# EasyEDA Pro project ProProject_Driver_STM32F405_2023-10-07.epro, board PCB1_1
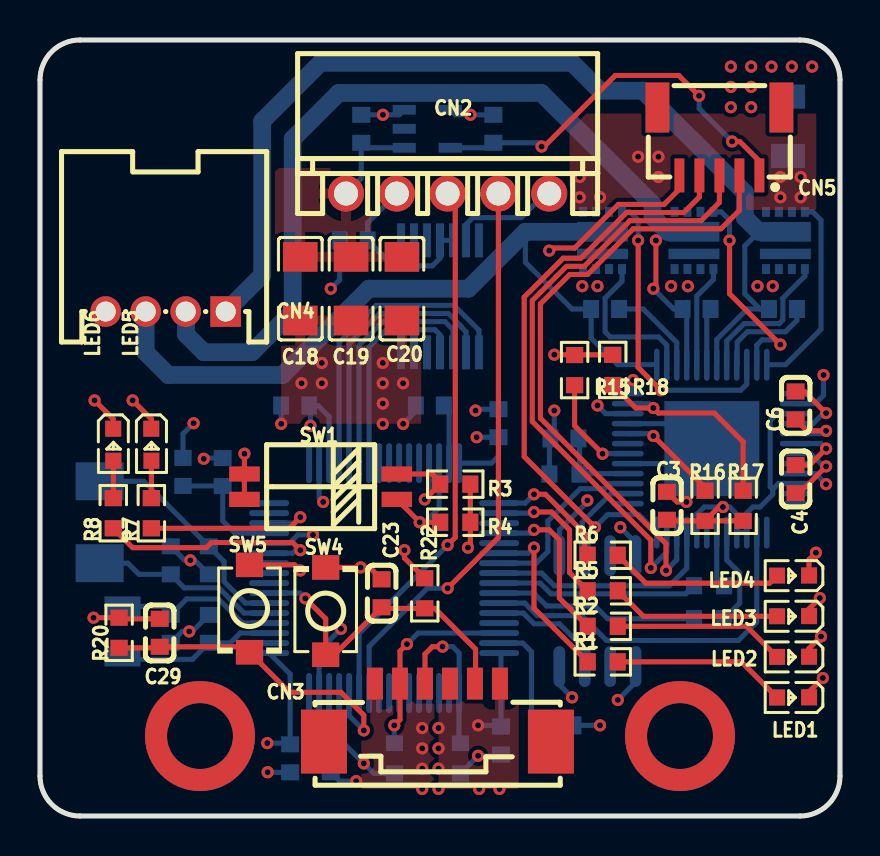
[diagram p6: board, top side]
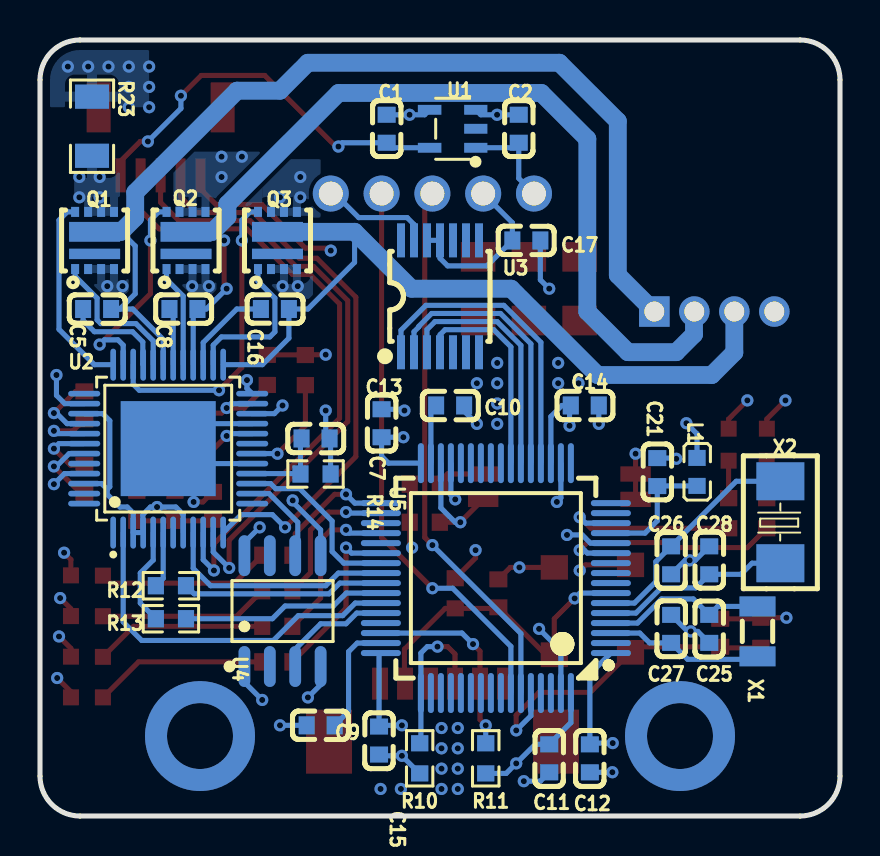
[diagram p7: board, bottom side, seen from below]

Outline 40 x 38.82 mm; copper layers: Top Layer, Inner1, Inner2, Bottom Layer. Coordinates in mm from the lower left corner of the outline.
Outline path: 0,36.82 0,2 arc(0.59,0.59) 2,0 38,0 arc(39.41,0.59) 40,2 40,36.82 arc(39.41,38.24) 38,38.82 2,38.82 arc(0.59,38.24) 0,36.82
Stack: Top Layer 0.035mm / Dielectric1 0.48mm PP er 4.5 / Inner1 0.035mm / Dielectric2 0.48mm FR4 er 4.5 / Inner2 0.035mm / Dielectric3 0.48mm PP er 4.5 / Bottom Layer 0.035mm

## Design rules (mm)
spacing safeClearance (default): track to track 0.152, other pairs 0.152 to 0.3
track width trackWidth (default): min 0.127, default 0.254, max 2.54
differential pair differentialPair (default): width min 0.127, default 0.254, max 2.54; gap min 0.152, default 0.152
via viaSize (default): diameter min 0.5, default 0.61, max 10; hole min 0.3, default 0.305, max 6
net GND uses copperRegion1
net VCC uses copperRegion1
net GND_CS uses copperRegion1
net +16V uses copperRegion1

## Placement (name value [footprint] x y rotation side)
C1  4.7uF  [C0603]  22.67 34.38 270 bottom
C2  10uF  [C0603]  16.06 34.38 270 bottom
C3  1uF  [C0603]  31.35 15.52 270 top
C4  470nF  [C0603]  37.78 16.86 270 top
C5  33nF  [C0603]  37.15 25.36 0 bottom
C6  1uF  [C0603]  37.78 20.54 270 top
C7  1nF  [C0603]  26.22 18.89 0 bottom
C8  33nF  [C0603]  32.83 25.36 0 bottom
C9  100nF  [C0603]  25.97 4.54 180 bottom
C10  100nF  [C0603]  19.49 20.54 0 bottom
C11  100nF  [C0603]  14.54 2.89 90 bottom
C12  100nF  [C0603]  12.51 2.89 90 bottom
C13  100nF  [C0603]  22.92 19.65 270 bottom
C14  100nF  [C0603]  12.76 20.54 0 bottom
C15  100nF  [C0603]  23.05 3.78 90 bottom
C16  33nF  [C0603]  28.25 25.36 0 bottom
C17  100nF  [C0603]  15.68 28.79 180 bottom
C18  10uF  [C1206]  13.01 26.38 90 top
C19  10uF  [C1206]  15.56 26.38 90 top
C20  10uF  [C1206]  18.09 26.38 90 top
C21  100nF  [C0603]  9.14 17.21 270 bottom
C23  100nF  [C0603]  17.08 11.14 270 top
C25  20pF  [C0603]  6.54 9.36 90 bottom
C26  20pF  [C0603]  8.44 12.79 90 bottom
C27  20pF  [C0603]  8.44 9.36 270 bottom
C28  20pF  [C0603]  6.54 12.79 270 bottom
C29  100nF  [C0603]  5.99 9.17 90 top
CN2  5264-5AWD米色  [CONN-TH_5P-P2.50_5264-5AWD]  20.38 31.84 0 top
CN3  532610671  [CONN-SMD_6P-P1.25_53261-0671]  19.87 5.17 0 top
CN4  X2011WR-04A-N0SN  [CONN-TH_X2011WR-04A-N0SN]  6.28 25.24 180 top
CN5  X1002WRS-05L-HF-LPSW  [CONN-SMD_X1002WRS-05L-HF-LPSN]  33.97 33.75 180 top
L1  3.3uH  [L0603]  7.15 17.22 270 bottom
LED1  XL-1608SURC-06  [LED0603-RD_RED]  37.65 5.93 180 top
LED2  XL-1608SYGC-06  [LED0603-RD_GREEN]  37.65 7.97 180 top
LED3  XL-1608SYGC-06  [LED0603-RD_GREEN]  37.65 10 180 top
LED4  XL-1608SYGC-06  [LED0603-RD_GREEN]  37.65 12.03 180 top
LED5  XL-1608UBC-04  [LED0603-RD_BLUE]  5.57 18.58 270 top
LED6  XL-1608UBC-04  [LED0603-RD_BLUE]  3.66 18.58 270 top
Q1  TDM3412  [DFN3X3E-8_L3.0-W3.0-P0.65-BL-EP2]  37.27 28.79 180 bottom
Q2  TDM3412  [DFN3X3E-8_L3.0-W3.0-P0.65-BL-EP2]  32.7 28.79 180 bottom
Q3  TDM3412  [DFN3X3E-8_L3.0-W3.0-P0.65-BL-EP2]  28.13 28.79 180 bottom
R1  1kΩ  [R0603]  28.14 7.71 180 top
R2  1kΩ  [R0603]  28.14 9.49 180 top
R3  806kΩ  [R0603]  20.76 16.6 0 top
R4  806kΩ  [R0603]  20.76 14.7 0 top
R5  1kΩ  [R0603]  28.14 11.27 180 top
R6  1kΩ  [R0603]  28.14 13.05 180 top
R7  1kΩ  [R0603]  5.57 15.15 270 top
R8  1kΩ  [R0603]  3.66 15.15 270 top
R10  10kΩ  [R0603]  21.02 2.89 90 bottom
R11  10kΩ  [R0603]  17.71 2.89 90 bottom
R12  1kΩ  [R0603]  33.45 11.52 0 bottom
R13  1kΩ  [R0603]  33.45 9.87 0 bottom
R14  47kΩ  [R0603]  26.22 17.11 0 bottom
R15  10kΩ  [R0603]  26.73 22.31 90 top
R16  100kΩ  [R0603]  33.25 15.52 90 top
R17  100kΩ  [R0603]  35.16 15.52 90 top
R18  10kΩ  [R0603]  28.64 22.32 270 top
R20  10kΩ  [R0603]  3.96 9.17 90 top
R22  10kΩ  [R0603]  19.24 11.14 90 top
R23  25mΩ  [R1206]  37.4 34.51 270 bottom
SW1  DSHP02TSGER  [SW-SMD_DSHP02TSGER]  14.03 16.47 90 top
SW4  TS-1088-AR02016  [SW-SMD_L3.9-W3.0-P4.45]  14.28 10.25 90 top
SW5  TS-1088-AR02016  [SW-SMD_L3.9-W3.0-P4.45]  10.47 10.38 270 top
U1  TPS7B6950DBVR  [SOT-23-5_L3.0-W1.7-P0.95-LS2.8-BL]  19.37 34.38 90 bottom
U2  A3930KJPTR-T  [LQFP-48_L7.0-W7.0-P0.50-LS9.0-BL-EP]  33.59 18.38 180 bottom
U3  AS5047P-ATSM  [TSSOP-14_L5.0-W4.4-P0.65-LS6.4-BL]  20 26 180 bottom
U4  π122U31  [SOIC-8_L4.9-W3.9-P1.27-LS6.0-BL]  27.87 10.25 180 bottom
U5  STM32F405RGT6  [LQFP-64_L10.0-W10.0-P0.50-LS12.0-BL]  17.21 11.9 90 bottom
X1  32.768kHz  [FC-135R_L3.2-W1.5]  4.12 9.24 270 bottom
X2  8MHz  [CRYSTAL-SMD_L5.0-W3.2]  2.98 14.7 270 bottom

## Footprints (pads in the part's own frame, mm; a bottom-side part is the same pattern mirrored in y, then rotated)
C0603
  rect 0.8x0.9 smd: 1(-0.7,0) 2(0.7,0)
C1206
  rect 1.485x1.728 smd: 1(-1.593,0) 2(1.593,0)
CONN-SMD_6P-P1.25_53261-0671
  rect 0.8x1.6 smd: 1(3.124,1.45) 2(1.875,1.45) 3(0.625,1.45) 4(-0.625,1.45) 5(-1.875,1.45) 6(-3.124,1.45)
  rect 2.301x3.2 smd: 7(-5.675,-1.45) 8(5.675,-1.45)
CONN-SMD_X1002WRS-05L-HF-LPSN
  rect 0.5x1.7 smd: 1(-2,1.7) 2(-1,1.7) 3(0,1.7) 4(1,1.7) 5(2,1.7)
  rect 1.2x2.5 smd: 6(3.1,-1.7) 7(-3.1,-1.7)
CONN-TH_5P-P2.50_5264-5AWD
  round 1.801 hole 1.199: 1(-5.08,-0.701) 2(-2.54,-0.701) 3(0,-0.701) 4(2.54,-0.701) 5(5.08,-0.701)
CONN-TH_X2011WR-04A-N0SN
  rect 1.524x1.524 hole 1: 1(-3,0)
  round 1.524 hole 1: 2(-1,0) 3(1,0) 4(3,0)
CRYSTAL-SMD_L5.0-W3.2
  rect 1.9x2.4 smd: 1(-2.05,0) 2(2.05,0)
DFN3X3E-8_L3.0-W3.0-P0.65-BL-EP2
  rect 0.4x0.5 smd: 1(-0.973,-1.43) 2(-0.323,-1.43) 3(0.328,-1.43) 4(0.973,-1.43) 5(0.973,1.43) 6(0.328,1.43) 7(-0.323,1.43) 8(-0.973,1.43)
  rect 2.55x0.52 smd: 9(0.003,-0.672)
  rect 2.55x0.99 smd: 10(0.003,0.433)
FC-135R_L3.2-W1.5
  rect 1x1.8 smd: 1(-1.25,0) 2(1.25,0)
L0603
  rect 0.8x0.864 smd: 1(-0.7,0) 2(0.7,0)
LED0603-RD_BLUE
  rect 0.8x0.8 smd: 1(-0.799,-0.004) 2(0.799,0.004)
LED0603-RD_GREEN
  rect 0.8x0.8 smd: 1(-0.799,-0.004) 2(0.799,0.004)
LED0603-RD_RED
  rect 0.8x0.8 smd: 1(-0.799,-0.004) 2(0.799,0.004)
LQFP-48_L7.0-W7.0-P0.50-LS9.0-BL-EP
  oval 0.28x1.6 smd: 1(-2.75,-4.2) 2(-2.25,-4.2) 3(-1.75,-4.2) 4(-1.25,-4.2) 5(-0.75,-4.2) 6(-0.25,-4.2) 7(0.25,-4.2) 8(0.75,-4.2) 9(1.25,-4.2) 10(1.75,-4.2) 11(2.25,-4.2) 12(2.75,-4.2) 25(2.75,4.2) 26(2.25,4.2) 27(1.75,4.2) 28(1.25,4.2) 29(0.75,4.2) 30(0.25,4.2) 31(-0.25,4.2) 32(-0.75,4.2) 33(-1.25,4.2) 34(-1.75,4.2) 35(-2.25,4.2) 36(-2.75,4.2)
  oval 1.6x0.28 smd: 13(4.2,-2.75) 14(4.2,-2.25) 15(4.2,-1.75) 16(4.2,-1.25) 17(4.2,-0.75) 18(4.2,-0.25) 19(4.2,0.25) 20(4.2,0.75) 21(4.2,1.25) 22(4.2,1.75) 23(4.2,2.25) 24(4.2,2.75) 37(-4.2,2.75) 38(-4.2,2.25) 39(-4.2,1.75) 40(-4.2,1.25) 41(-4.2,0.75) 42(-4.2,0.25) 43(-4.2,-0.25) 44(-4.2,-0.75) 45(-4.2,-1.25) 46(-4.2,-1.75) 47(-4.2,-2.25) 48(-4.2,-2.75)
  rect 4.75x4.75 smd: 49(0,0)
LQFP-64_L10.0-W10.0-P0.50-LS12.0-BL
  oval 0.3x2 smd: 1(-3.75,-5.75) 2(-3.25,-5.75) 3(-2.75,-5.75) 4(-2.25,-5.75) 5(-1.75,-5.75) 6(-1.25,-5.75) 7(-0.75,-5.75) 8(-0.25,-5.75) 9(0.25,-5.75) 10(0.75,-5.75) 11(1.25,-5.75) 12(1.75,-5.75) 13(2.25,-5.75) 14(2.75,-5.75) 15(3.25,-5.75) 16(3.75,-5.75) 33(3.75,5.75) 34(3.25,5.75) 35(2.75,5.75) 36(2.25,5.75) 37(1.75,5.75) 38(1.25,5.75) 39(0.75,5.75) 40(0.25,5.75) 41(-0.25,5.75) 42(-0.75,5.75) 43(-1.25,5.75) 44(-1.75,5.75) 45(-2.25,5.75) 46(-2.75,5.75) 47(-3.25,5.75) 48(-3.75,5.75)
  oval 2x0.3 smd: 17(5.75,-3.75) 18(5.75,-3.25) 19(5.75,-2.75) 20(5.75,-2.25) 21(5.75,-1.75) 22(5.75,-1.25) 23(5.75,-0.75) 24(5.75,-0.25) 25(5.75,0.25) 26(5.75,0.75) 27(5.75,1.25) 28(5.75,1.75) 29(5.75,2.25) 30(5.75,2.75) 31(5.75,3.25) 32(5.75,3.75) 49(-5.75,3.75) 50(-5.75,3.25) 51(-5.75,2.75) 52(-5.75,2.25) 53(-5.75,1.75) 54(-5.75,1.25) 55(-5.75,0.75) 56(-5.75,0.25) 57(-5.75,-0.25) 58(-5.75,-0.75) 59(-5.75,-1.25) 60(-5.75,-1.75) 61(-5.75,-2.25) 62(-5.75,-2.75) 63(-5.75,-3.25) 64(-5.75,-3.75)
R0603
  rect 0.806x0.864 smd: 1(-0.753,0) 2(0.753,0)
R1206
  rect 1.208x1.701 smd: 1(-1.479,0) 2(1.479,0)
SOIC-8_L4.9-W3.9-P1.27-LS6.0-BL
  oval 0.588x2.045 smd: 1(-1.905,-2.772) 2(-0.635,-2.772) 3(0.635,-2.772) 4(1.905,-2.772) 5(1.905,2.772) 6(0.635,2.772) 7(-0.635,2.772) 8(-1.905,2.772)
SOT-23-5_L3.0-W1.7-P0.95-LS2.8-BL
  rect 0.49x1.157 smd: 1(-0.95,-1.153) 2(0,-1.153) 3(0.95,-1.153)
  rect 0.49x1.175 smd: 4(0.95,1.153) 5(-0.95,1.153)
SW-SMD_DSHP02TSGER
  rect 0.762x1.524 smd: 1(-0.635,-3.81) 2(0.635,-3.81) 3(0.635,3.81) 4(-0.635,3.81)
SW-SMD_L3.9-W3.0-P4.45
  rect 1.23x1.36 smd: 1(-2.185,0) 2(2.185,0)
TSSOP-14_L5.0-W4.4-P0.65-LS6.4-BL
  rect 0.4x1.7 smd: 1(-1.95,-2.8) 2(-1.3,-2.8) 3(-0.65,-2.8) 4(0,-2.8) 5(0.65,-2.8) 6(1.3,-2.8) 7(1.95,-2.8) 8(1.95,2.8) 9(1.3,2.8) 10(0.65,2.8) 11(0,2.8) 12(-0.65,2.8) 13(-1.3,2.8) 14(-1.95,2.8)

## Nets
As in the schematic.

Pads without a net: CN3 3 7 8; CN4 4; CN5 6 7; U1 2; U2 1 7 13 19 37 44 47 48; U3 5 6 7 8 9 10 14; U4 2 7; U5 2 8 9 10 15 16 17 24 25 26 27 35 37 45 50 51 52 53 54 55 56 57 61 62

## Via types
v1: diameter 5.5, hole 3.3, Top Layer to Bottom Layer, 2 vias
v2: diameter 0.61, hole 0.305, Top Layer to Bottom Layer, 124 vias

## Routing (per net, layer and track width the routed paths; a pad name or vN(x,y) marks a point on that pad's centre or on a via; arc(x,y) is an arc through that point)
+5V: length 20
  Top Layer w0.254: v2(25.08,33.49) 25.21,33.49 28.76,37.05 31.94,37.05 v2(32.95,36.03) ; v2(34.6,33.75) 34.99,33.75 35.97,32.76 CN5.1
  Bottom Layer w0.254: v2(34.6,33.75) 32.95,35.4 v2(32.95,36.03) ; U1.5 22.42,33.43 C1.2 24.89,33.68 v2(25.08,33.49)
+16V: length 24.4
  Inner1 w0.254: v2(39.3,16.6) 35.88,20.03 v2(35.88,26.51) ; v2(29.65,21.81) 29.65,24.73 v2(27.87,26.51)
  Bottom Layer w0.254: U2.24 29.65,21.39 v2(29.65,21.81) ; U2.45 38.78,17.13 v2(39.3,16.6) ; U1.1 16.31,33.43 C2.2 16.06,31.9 CN2.1
  vias: v2(27.11,26.51) v2(31.56,26.51) v2(32.39,26.51) v2(36.64,26.51)
GND: length 87.2
  Top Layer w0.254: C3.1 31.85,15.71 v2(32.32,15.71) ; v2(2.73,20.79) 3.66,19.86 LED6.1 ; R18.1 26.74,23.07 R15.2 26.71,23.08 v2(25.72,23.08) ; LED5.1 5.56,19.86 v2(4.63,20.79) ; R3.2 R4.2 21.52,13.55 v2(21.4,13.43) ; LED3.1 38.45,10.36 v2(38.99,10.9) ; v2(25.46,28.29) 25.59,28.41 26.73,28.41 28.92,30.6 31.2,30.6 31.97,31.37 CN5.5 ; v2(39.05,8.98) 38.45,8.38 LED2.1 ; v2(39.3,19.27) 38.35,19.27 C6.2 ; LED4.1 38.45,12.83 v2(38.8,13.17) ; LED1.1 38.45,6.21 v2(39.14,6.9) ; 17.08,11.84 16.48,12.44 v2(16.03,12.44) SW4.2 ; C29.2 4.01,9.87 R20.2 v2(2.68,9.92)
  Bottom Layer w0.254: v2(15.81,1.74) 14.98,1.74 C11.1 ; v2(14.16,15.71) 13.96,15.92 U5.18 ; U2.21 32.34,19.63 33.09,18.88 ; v2(25.72,20.28) 25.72,19.08 C7.1 25.47,18.83 R14.1 ; C21.1 8.22,17.91 v2(8.19,17.87) ; 27.37,15.71 25.97,14.32 U4.5 ; v2(14.54,26.38) 14.98,26.82 C17.2 ; C1.1 v2(21.52,35.08) 20.77,35.08 U1.4 ; C13.1 21.84,20.35 v2(21.78,20.28) ; C27.1 7.62,9.24 7.11,9.24 C25.1 ; C2.1 v2(17.15,35.08) 17.96,35.08 U1.3 ; C12.1 11.39,2.19 v2(11.38,2.19) ; C15.1 22.99,3.01 v2(21.91,3.01) 21.02,2.13 R10.1 ; U4.4 25.97,6.57 v2(26.6,5.93) ; U5.12 12.48,13.65 12.89,14.06 v2(13.65,14.06) ; C9.1 v2(28,4.54) ; U5.63 13.96,8.27 v2(15.05,9.36) ; U2.49 32.84,17.63 U2.17 ; CN2.5 25.27,31.14 24.06,29.94 21.64,29.94 21.3,29.59 U3.13 ; v2(18.16,19.62) 18.79,20.26 C10.1 ; v2(39.3,19.27) 39.16,19.13 U2.41 ; C26.1 7.74,12.79 7.24,12.79 C28.1 ; C14.1 v2(12.06,19.62)
  vias: v2(7.52,12.79) v2(7.46,9.24) v2(13.08,21.65) v2(14.09,22.67) v2(14.09,21.65) v2(17.14,22.67) v2(17.14,21.65) v2(17.14,20.64) v2(17.14,19.62) v2(18.16,21.65) v2(19.11,4.4) v2(19.11,3.39) v2(19.11,2.37) v2(19.11,1.35) v2(27.37,15.79) v2(34.54,37.49) v2(34.54,36.48) v2(34.54,35.46) v2(35.56,37.49) v2(35.56,36.48) v2(35.56,35.46) v2(36.58,37.49) v2(37.59,37.49) v2(38.61,37.49)
GND_CS: length 24.8
  Inner2 w0.254: v2(39.18,22.06) 39.18,29.81 v2(38.03,30.95) ; v2(28,30.95) 28.89,30.06 28.89,22.32 27.87,21.3 v2(27.87,20.54)
  Bottom Layer w0.254: U2.22 28.28,20.13 v2(27.87,20.54) ; v2(39.18,22.06) 39.18,21.05 38.76,20.63 U2.38
  vias: v2(26.99,31.97) v2(26.99,30.95) v2(29.91,32.98) v2(30.92,32.98) v2(30.92,31.97) v2(37.02,31.97) v2(37.02,30.95) v2(38.03,31.97)
VCC: length 47.9
  Top Layer w0.254: v2(10.22,18.13) SW1.3 SW1.4 ; v2(18.22,13.3) 18.22,12.91 R22.2 ; v2(13.01,12.28) 12.74,12.56 SW5.1
  Bottom Layer w0.254: U5.32 22.57,17.65 22.92,18 C13.2 v2(21.83,18.95) ; v2(13.52,19.52) 13.52,20.48 C14.2 13.9,20.54 14.46,19.99 U5.19 ; v2(29.02,14.44) 29.78,13.68 U4.8 ; 12.44,3.65 12.51,3.71 12.51,7.1 U5.1 ; 12.44,3.65 C12.2 ; 12.44,3.65 v2(11.36,3.65) ; v2(28.89,5.81) 29.78,6.7 U4.1 ; R11.1 16.69,2.13 v2(16.19,2.63) 15.24,3.59 C11.2 13.46,4.67 U5.64 ; U5.48 23.05,8.06 C15.2 22.99,4.54 v2(21.91,4.54) ; CN2.2 16.38,29.68 C17.1 17.65,27.52 19.62,27.52 20,27.91 U3.11 U3.12 ; L1.1 7.15,19.12 v2(7.68,19.65)
  vias: v2(19.92,4.4) v2(19.92,3.39) v2(19.92,2.37) v2(19.92,1.35) v2(21.96,1.35) v2(22.97,1.35)
VDDA: length 6.3
  Bottom Layer w0.254: L1.2 9.13,16.52 C21.2 9.14,14.77 9.75,14.15 U5.13
(no net):
  vias: v1(8,4) v1(32,4)
A_OUT: length 50.9
  Bottom Layer w0.254: 36.44,25.36 36,25.36 ; 36,25.36 35.36,25.36 33.84,23.84 U2.31 ; 36,25.36 35.24,26.13 35.24,28.52 35.95,29.23
  Bottom Layer w0.889: CN4.1 11.11,27.06 11.11,34.76 14.03,37.68 26.6,37.68 28,36.29 30.15,36.29 35.24,31.19 35.24,29.94 35.95,29.23 Q1.10
ADDRESS1: length 5.4
  Top Layer w0.254: v2(19.24,15.84) 20.01,16.61 20.01,16.73 19.63,17.11 SW1.2
  Bottom Layer w0.254: v2(19.24,15.84) 19.46,16.06 U5.29
ADDRESS2: length 6.1
  Top Layer w0.254: SW1.1 v2(18.98,14.7) R4.1
  Bottom Layer w0.254: v2(18.98,14.7) 19.24,14.7 19.96,15.42 U5.30
B_OUT: length 48.4
  Top Layer w0.254: v2(30.79,28.79) 30.79,26.51 v2(30.67,26.38)
  Bottom Layer w0.254: v2(30.67,26.38) 31.68,25.36 C8.1 32.34,25.15 U2.28 ; v2(30.79,28.79) 31.1,29.1 31.1,29.23
  Bottom Layer w0.889: CN4.2 7.3,25.22 7.3,24.09 8.19,23.21 10.6,23.21 12.63,25.24 12.63,33.87 14.93,36.17 25.07,36.17 30.63,30.61 30.63,29.97 31.38,29.23 Q2.10
BOOT0: length 16.6
  Top Layer w0.254: R20.1 5.93,8.41 C29.1 10.2,8.47 SW5.2 12.48,6.19 15.05,6.19 16.19,5.05 v2(16.19,4.28)
  Bottom Layer w0.254: U5.60 15.46,5.02 v2(16.19,4.28)
C_OUT: length 39.4
  Bottom Layer w0.254: U2.25 28.88,22.58 27.56,23.91 C16.1 26.6,25.36 24.27,27.7 24.27,29.23
  Bottom Layer w0.889: Q3.10 24.27,29.23 21.43,26.38 16.44,26.38 12.13,22.06 6.41,22.06 5.28,23.19 CN4.3
CA: length 5.1
  Bottom Layer w0.254: C5.2 37.84,24.8 37.28,24.23 35.37,24.23 34.86,23.71 34.86,22.6 U2.33
CB: length 2.9
  Bottom Layer w0.254: C8.2 33.34,25.18 U2.30
CC: length 4.7
  Bottom Layer w0.254: 28.96,25.36 30.16,25.36 31.84,23.69 U2.27
DIR: length 11.8
  Bottom Layer w0.254: U5.40 25.08,12.15 25.72,11.52 31.47,11.52 32.34,12.39 U2.9
FF1: length 10.1
  Bottom Layer w0.254: R12.1 32.29,11.12 25.55,11.12 25.01,11.65 U5.41
FF2: length 10.3
  Bottom Layer w0.254: R13.1 28.38,9.87 27.75,10.51 25.33,10.51 24.69,11.15 U5.42
GHA: length 7.4
  Bottom Layer w0.254: U2.32 34.34,23.77 35.21,24.64 36.96,24.64 37.15,24.82 37.15,25.91 38.24,27.01 Q1.1
GHB: length 5.1
  Bottom Layer w0.254: Q2.1 33.67,26.85 32.84,26.01 U2.29
GHC: length 7.8
  Bottom Layer w0.254: U2.26 31.34,23.56 30.93,23.97 28.51,23.97 28.25,24.22 28.25,25.91 29.1,26.76 Q3.1
GLA: length 9.9
  Bottom Layer w0.254: Q1.8 38.64,30.22 39.05,29.81 39.05,24.35 37.28,22.58 U2.36
GLB: length 10.6
  Top Layer w0.254: v2(37.02,23.59) 34.48,26.13 v2(34.48,28.79)
  Bottom Layer w0.254: U2.35 35.84,23.56 36.1,23.82 36.78,23.82 v2(37.02,23.59) ; Q2.8 34.06,30.22 34.48,29.81 v2(34.48,28.79)
GLC: length 15.4
  Top Layer w0.254: v2(29.91,28.79) 29.91,22.44 v2(31.05,21.3)
  Bottom Layer w0.254: v2(31.05,21.3) 35.04,21.3 35.34,21.6 U2.34 ; Q3.8 29.49,30.22 29.91,29.81 v2(29.91,28.79)
HA: length 31.7
  Top Layer w0.254: v2(31.3,12.28) 31.3,13.62 25.02,19.9 25.02,25.62 26.49,27.09 27.38,27.09 29.66,29.38 34.05,29.38 34.97,30.3 CN5.2
  Bottom Layer w0.254: U2.10 31.84,12.82 v2(31.3,12.28)
HB: length 30.7
  Top Layer w0.254: CN5.3 33.97,30.7 33.06,29.78 29.5,29.78 27.21,27.5 26.32,27.5 24.62,25.79 24.62,19.73 30.54,13.81 v2(30.54,12.41)
  Bottom Layer w0.254: U2.11 31.34,13.21 v2(30.54,12.41)
HC: length 28.6
  Top Layer w0.254: v2(27.75,14.44) 24.21,17.98 24.21,25.96 26.16,27.91 27.04,27.91 29.33,30.19 32.19,30.19 32.97,30.97 CN5.4
  Bottom Layer w0.254: U2.12 29.94,15.08 28.38,15.08 v2(27.75,14.44)
I2C1_SCL: length 28.3
  Top Layer w0.254: CN2.4 22.92,13.94 v2(20.38,11.39)
  Bottom Layer w0.254: U5.58 16.46,8.49 19.37,11.39 v2(20.38,11.39)
I2C1_SDA: length 27.1
  Top Layer w0.254: v2(20.38,13.55) 20.76,13.94 20.76,30.76 CN2.3
  Bottom Layer w0.254: U5.59 15.96,9.13 v2(20.38,13.55)
LED1: length 8.7
  Top Layer w0.254: v2(24.7,13.43) 24.7,10.4 R1.2
  Bottom Layer w0.254: U5.38 24.43,13.15 v2(24.7,13.43)
LED2: length 8.2
  Top Layer w0.254: R2.2 25.97,10.9 25.97,13.81 25.46,14.32 v2(24.7,14.32)
  Bottom Layer w0.254: v2(24.7,14.32) 24.54,14.15 U5.36
LED3: length 7.3
  Top Layer w0.254: v2(24.7,15.2) 25.58,15.2 26.48,14.31 26.48,12.17 R5.2
  Bottom Layer w0.254: v2(24.7,15.2) 24.65,15.15 U5.34
LED4: length 6.1
  Top Layer w0.254: v2(24.7,16.09) 25.27,16.09 27.24,14.12 27.24,13.3
  Bottom Layer w0.254: v2(24.7,16.09) 24.26,15.65 U5.33
LED5: length 9.4
  Top Layer w0.254: R7.2 12.46,14.39 v2(13.01,14.95)
  Bottom Layer w0.254: U5.14 12.72,14.65 v2(13.01,14.95)
LED6: length 11.6
  Top Layer w0.254: R8.2 4.63,13.43 8.32,13.43 8.57,13.68 12.63,13.68 v2(13.01,13.3)
  Bottom Layer w0.254: U5.11 12.63,13.15 12.78,13.3 v2(13.01,13.3)
MOTOR_MODE: length 9
  Bottom Layer w0.254: U2.15 28.47,16.63 28.22,16.38 27.01,16.38 25.4,14.76 25.4,13.23 24.81,12.65 U5.39
MOTOR_RESET: length 18.5
  Bottom Layer w0.254: U2.2 35.84,9.71 34.91,8.78 28.33,8.78 27.09,10.02 24.87,10.02 24.24,10.65 U5.43
NRST: length 16.2
  Top Layer w0.254: v2(13.27,10.89) 14.28,9.87 SW4.1 14.71,8.07 C23.2 17.13,10.39 R22.1 19.74,10.39 21.78,8.35 21.78,6.65 CN3.2
  Bottom Layer w0.254: v2(13.27,10.89) 13,11.15 U5.7
OSC32_IN: length 7.9
  Bottom Layer w0.254: U5.3 10.01,9.15 9.52,8.66 C27.2 7.62,7.84 4.27,7.84 X1.2
OSC32_OUT: length 8.3
  Bottom Layer w0.254: U5.4 10.13,9.65 8.92,10.86 7.33,10.86 C25.2 6.12,10.49 X1.1
OSC_IN: length 9.5
  Bottom Layer w0.254: 3,12.65 4.4,12.65 4.95,12.09 C28.2 7.22,11.41 8.94,11.41 10.2,10.15 U5.5
OSC_OUT: length 11.6
  Bottom Layer w0.254: U5.6 10.28,10.65 9.21,11.73 9.21,12.73 C26.2 5.19,16.75 X2.1
PWM: length 5.8
  Bottom Layer w0.254: U5.44 24.16,10.15 24.7,9.62 25.97,9.62 27.11,8.47 27.11,7.48
PWM_V: length 4.5
  Bottom Layer w0.254: U2.14 28.54,16.13 27.11,14.7 27.11,13.02
SPI_MISO: length 12.4
  Bottom Layer w0.254: U5.22 15.96,23.55 17.15,24.74 20.25,24.74 20.65,24.33 U3.3
SPI_MOSI: length 10.7
  Bottom Layer w0.254: U3.4 20,24.08 19.75,24.33 17.31,24.33 16.46,23.47 U5.23
SPI_NSS: length 15.4
  Bottom Layer w0.254: U5.20 14.96,23.7 16.81,25.55 20.71,25.55 21.95,24.3 U3.1
SPI_SCK: length 13.9
  Bottom Layer w0.254: U5.21 15.46,23.62 16.98,25.14 20.42,25.14 21.06,24.5 21.06,24.47 21.3,24.23 U3.2
SWCLK: length 8
  Top Layer w0.254: CN3.4 19.25,8.1 19.62,8.47 v2(20.13,8.47)
  Bottom Layer w0.254: R10.2 20.96,3.7 U5.49 20.96,8.15 20.63,8.47 v2(20.13,8.47)
SWDIO: length 10.1
  Top Layer w0.254: v2(17.71,4.54) 18,4.82 CN3.5 18,8.25 v2(18.35,8.6)
  Bottom Layer w0.254: v2(17.71,4.54) R11.2 ; U5.46 18.9,9.15 v2(18.35,8.6)
$1N4505: length 5.8
  Bottom Layer w0.254: U5.47 24.14,8.65 24.57,8.22 24.57,5.23 C9.2
$1N4511: length 3
  Bottom Layer w0.254: U5.31 20.46,20.28 C10.2
$1N104760: length 1.9
  Top Layer w0.254: R8.1 3.67,15.91 LED6.2
$1N104762: length 1.9
  Top Layer w0.254: R7.1 5.57,15.91 LED5.2
$1N104764: length 8.7
  Top Layer w0.254: LED1.2 35.07,7.71 R1.1
$1N104766: length 8.6
  Top Layer w0.254: R2.1 35.33,9.49 LED2.2
$1N104768: length 8.5
  Top Layer w0.254: LED3.2 30.16,9.99 R5.1
$1N104770: length 8.7
  Top Layer w0.254: LED4.2 36.48,11.65 30.29,11.65 R6.1
$2N2664: length 4.9
  Bottom Layer w0.254: U2.5 34.34,12.8 34.99,12.16 34.99,10.65 34.21,9.87
$2N2665: length 2.8
  Bottom Layer w0.254: 34.21,11.52 33.84,11.89 U2.6
$2N2672: length 3.9
  Top Layer w0.254: v2(39.3,17.49) 37.97,16.16 C4.2
  Bottom Layer w0.254: v2(39.3,17.49) 39.18,17.49 38.54,18.13 U2.43
$2N2678: length 3.7
  Top Layer w0.254: v2(39.3,20.16) 38.22,21.24 C6.1
  Bottom Layer w0.254: U2.40 38.65,19.63 39.18,20.16 v2(39.3,20.16)
$2N2679: length 3.5
  Top Layer w0.254: C4.1 38.48,17.56 v2(39.3,18.38)
  Bottom Layer w0.254: v2(39.3,18.38) 39.05,18.63 U2.42
$2N2680: length 5.1
  Top Layer w0.254: v2(30.67,19.02) 33.25,16.43 R16.2
  Bottom Layer w0.254: U2.20 30.55,19.13 v2(30.67,19.02)
$2N2681: length 4.2
  Bottom Layer w0.254: C7.2 26.98,18.83 R14.2 27,17.13 U2.16
$2N2682: length 11.5
  Top Layer w0.254: R17.2 35.16,18.72 33.72,20.16 30.92,20.16 v2(30.67,20.41) 29.79,20.41 R18.2
  Bottom Layer w0.254: U2.23 30.45,20.63 v2(30.67,20.41)
$2N2684: length 5.3
  Top Layer w0.254: v2(28.13,18.13) 26.73,19.52 26.73,21.56
  Bottom Layer w0.254: v2(28.13,18.13) 28.13,18.13 U2.18
$2N2699: length 18.8
  Top Layer w0.254: C3.2 31.4,14.77 R16.1 ; R16.1 R17.1 ; R16.1 33.95,15.46 v2(34.15,15.46)
  Bottom Layer w0.254: 36.64,16.35 36.51,16.47 36.51,19.78 36.86,20.13 U2.39 ; 36.64,16.35 36.92,16.63 U2.46 ; 36.64,16.35 36.64,16.09 36,15.46 35.64,15.46 35.34,15.16 U2.3 U2.4 34.86,14.2 34.86,15.08 34.48,15.46 v2(34.15,15.46) 33.21,15.46 32.84,15.09 U2.8

## Copper pours and planes (outline as drawn; the poured copper is in the pictures)
+16V on Top Layer: 11.75,27.14 19.02,27.14 19.19,27.31 19.19,28.9 19.03,29.05 16.82,29.05 16.57,29.3 16.57,32.23 16.38,32.42 11.94,32.42 11.75,32.22
+16V on Bottom Layer: 31.18,28.41 33.97,28.41 33.97,26.13 31.18,26.13
+16V on Bottom Layer: 35.49,28.41 38.54,28.41 38.54,26.13 35.49,26.13
+16V on Bottom Layer: 26.35,28.41 29.4,28.41 29.4,25.87 26.35,25.87
+16V on Inner1: 11.75,32.35 11.75,26.82 12.7,25.87 38.03,25.87 39.05,26.89 39.05,28.43 38.68,28.79 17.21,28.79 16.57,29.43 16.57,32.35
GND on Top Layer: 12.06,25.55 19.06,25.55 19.06,19.62 12.06,19.62
GND on Top Layer: 16.06,7.46 19.92,7.46 19.92,1.35 16.06,1.35
GND on Bottom Layer: 34.54,39.97 39.81,39.97 39.81,35.46 34.54,35.46
GND on Inner2: -1.34,39.97 50.73,39.97 50.73,-1.05 -1.34,-1.05
GND_CS on Top Layer: 26.47,35.14 38.81,35.14 38.81,30.32 26.47,30.32
GND_CS on Bottom Layer: 28.89,33.24 33.34,33.24 33.34,29.94 28.89,29.94
GND_CS on Bottom Layer: 25.97,32.86 28.89,32.86 28.89,29.94 25.97,29.94
GND_CS on Bottom Layer: 36,33.75 38.29,33.75 38.29,29.94 36,29.94
VCC on Top Layer: 19.92,7.46 23.94,7.46 23.94,1.35 19.92,1.35
VCC on Inner1: -3.11,39.97 43.75,39.97 43.75,-2.45 -3.11,-2.45
